# EAGLE design stamp_module (EAGLE 8.0.0)
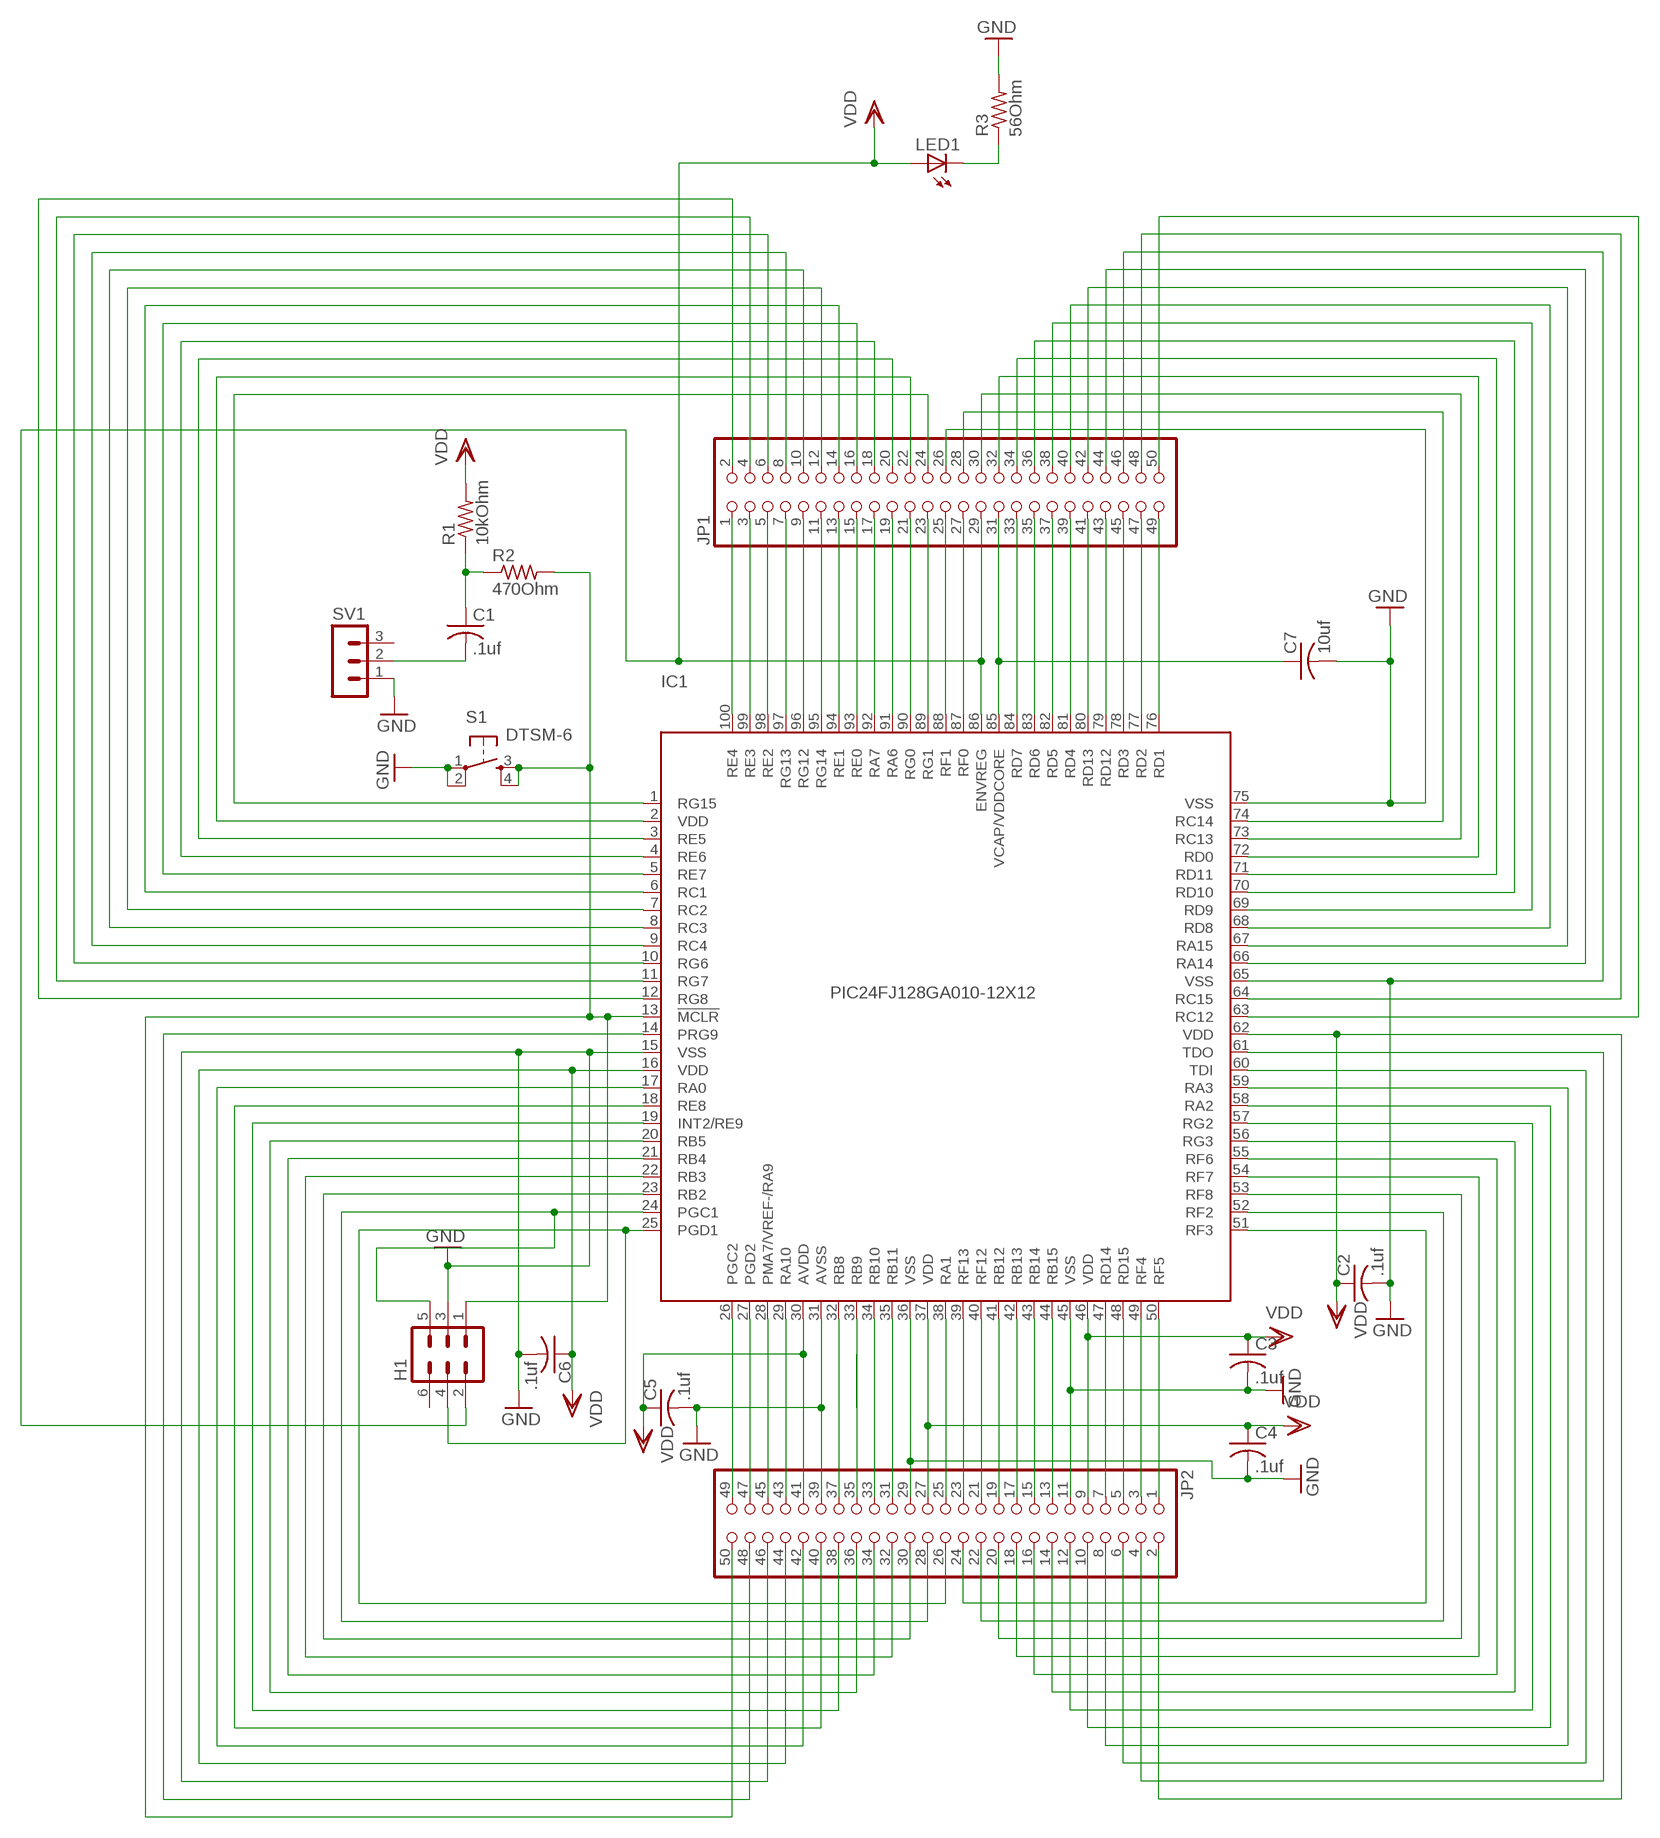
[diagram p0: schematic, sheet 1]

## Parts
C1  .1uf  C-USC1206  [C1206]
C2  .1uf  C-USC1206  [C1206]
C3  .1uf  C-USC1206  [C1206]
C4  .1uf  C-USC1206  [C1206]
C5  .1uf  C-USC1206  [C1206]
C6  .1uf  C-USC1206  [C1206]
C7  10uf  C-USC1206  [C1206]
H1  MA03-2  [MA03-2]
IC1  PIC24FJ128GA010-12X12  [SQFP-S-12X12-100]
JP1  PINHD-2X25  [2X25]
JP2  PINHD-2X25  [2X25]
LED1  LEDCHIPLED_0805  [CHIPLED_0805]
R1  10kOhm  R-US_R1206  [R1206]
R2  470Ohm  R-US_R1206  [R1206]
R3  56Ohm  R-US_R0805  [R0805]
S1  DTSM-6  [DTSM-6]
SV1  MA03-1  [MA03-1]

## Nets
GND: C2.2 C3.2 C4.2 C5.2 C6.2 C7.2 H1.3 IC1.15(VSS) IC1.31(AVSS) IC1.36(VSS) IC1.45(VSS) IC1.65(VSS) IC1.75(VSS) JP1.26 JP1.46 JP2.11 JP2.29 JP2.39 JP2.46 R3.2 S1.1 S1.2 SV1.1
N$1: IC1.88(RF1) JP1.25
N$2: C1.2 SV1.2
N$3: LED1.C R3.1
N$4: H1.5 IC1.24(PGC1) JP2.28
N$5: H1.1 IC1.13(!MCLR) JP2.50 R2.2 S1.3 S1.4
N$6: IC1.74(RC14) JP1.28
N$7: IC1.73(RC13) JP1.30
N$8: IC1.72(RD0) JP1.32
N$9: IC1.71(RD11) JP1.34
N$10: IC1.70(RD10) JP1.36
N$11: C1.1 R1.1 R2.1
N$12: IC1.69(RD9) JP1.38
N$13: IC1.68(RD8) JP1.40
N$14: IC1.67(RA15) JP1.42
N$15: IC1.66(RA14) JP1.44
N$16: H1.4 IC1.25(PGD1) JP2.26
N$17: IC1.61(TDO) JP2.4
N$18: IC1.64(RC15) JP1.48
N$19: IC1.63(RC12) JP1.50
N$20: IC1.60(TDI) JP2.6
N$21: IC1.59(RA3) JP2.8
N$22: IC1.58(RA2) JP2.10
N$23: IC1.57(RG2) JP2.12
N$24: IC1.56(RG3) JP2.14
N$25: IC1.55(RF6) JP2.16
N$26: IC1.54(RF7) JP2.18
N$27: IC1.53(RF8) JP2.20
N$28: IC1.52(RF2) JP2.22
N$29: IC1.51(RF3) JP2.24
N$30: IC1.50(RF5) JP2.1
N$31: IC1.49(RF4) JP2.3
N$32: IC1.38(RA1) JP2.25
N$33: IC1.47(RD14) JP2.7
N$34: IC1.44(RB15) JP2.13
N$35: IC1.34(RB10) JP2.33
N$36: IC1.42(RB13) JP2.17
N$37: IC1.41(RB12) JP2.19
N$38: IC1.40(RF12) JP2.21
N$39: IC1.39(RF13) JP2.23
N$40: IC1.48(RD15) JP2.5
N$41: IC1.35(RB11) JP2.31
N$42: IC1.43(RB14) JP2.15
N$43: IC1.33(RB9) JP2.35
N$44: IC1.32(RB8) JP2.37
N$45: IC1.29(RA10) JP2.43
N$46: IC1.28(PMA7/VREF-/RA9) JP2.45
N$47: IC1.27(PGD2) JP2.47
N$48: IC1.26(PGC2) JP2.49
N$49: IC1.4(RE6) JP1.18
N$50: IC1.6(RC1) JP1.14
N$51: IC1.3(RE5) JP1.20
N$52: IC1.2(VDD) JP1.22
N$53: IC1.5(RE7) JP1.16
N$54: IC1.7(RC2) JP1.12
N$55: IC1.8(RC3) JP1.10
N$56: IC1.9(RC4) JP1.8
N$57: IC1.10(RG6) JP1.6
N$58: IC1.11(RG7) JP1.4
N$59: IC1.12(RG8) JP1.2
N$60: IC1.14(PRG9) JP2.48
N$61: IC1.17(RA0) JP2.42
N$62: IC1.18(RE8) JP2.40
N$63: IC1.19(INT2/RE9) JP2.38
N$64: IC1.20(RB5) JP2.36
N$65: IC1.21(RB4) JP2.34
N$66: IC1.22(RB3) JP2.32
N$67: IC1.23(RB2) JP2.30
N$68: IC1.100(RE4) JP1.1
N$69: IC1.99(RE3) JP1.3
N$70: IC1.98(RE2) JP1.5
N$71: IC1.97(RG13) JP1.7
N$72: IC1.96(RG12) JP1.9
N$73: IC1.95(RG14) JP1.11
N$74: IC1.94(RE1) JP1.13
N$75: IC1.93(RE0) JP1.15
N$76: IC1.92(RA7) JP1.17
N$77: IC1.91(RA6) JP1.19
N$78: IC1.90(RG0) JP1.21
N$79: IC1.89(RG1) JP1.23
N$80: C7.1 IC1.85(VCAP/VDDCORE) JP1.31
N$81: IC1.87(RF0) JP1.27
N$82: IC1.84(RD7) JP1.33
N$83: IC1.83(RD6) JP1.35
N$84: IC1.82(RD5) JP1.37
N$85: IC1.81(RD4) JP1.39
N$86: IC1.80(RD13) JP1.41
N$87: IC1.79(RD12) JP1.43
N$88: IC1.78(RD3) JP1.45
N$89: IC1.77(RD2) JP1.47
N$90: IC1.76(RD1) JP1.49
N$91: IC1.1(RG15) JP1.24
VDD: C2.1 C3.1 C4.1 C5.1 C6.1 H1.2 IC1.16(VDD) IC1.30(AVDD) IC1.37(VDD) IC1.46(VDD) IC1.62(VDD) IC1.86(ENVREG) JP1.29 JP2.2 JP2.9 JP2.27 JP2.41 JP2.44 LED1.A R1.2
Unconnected: H1.6 SV1.3

## Library data of the parts
C1-C7 = rcl:C-US: CAPACITOR, American symbol
H1 = con-lstb:MA03-2: PIN HEADER; OC_FARNELL: unknown; OC_NEWARK: unknown
IC1 = ECE477_project:PIC24FJ128GA010: 64/80/100-Pin General Purpose, 16-Bit Flash Microcontrollers Source: http://ww1.microchip.com/downloads/en/DeviceDoc/39747d.pdf
JP1 JP2 = pinhead:PINHD-2X25: PIN HEADER
LED1 = led:LED: LED OSRAM: - CHIPLED LG R971, LG N971, LY N971, LG Q971, LY Q971, LO R971, LY R971 LH N974, LH R974 LS Q976, LO Q976, LY Q976 LO Q996 - Hyper CHIPLED LW Q18S LB Q993, LB Q99A, LB R99A - SideLED LS A670, LO A670, LY A670, LG A670, LP A670 LB A673, LV A673, LT A673, LW A673 LH A674 LY A675 LS A676, LA A676, LO A676, LY A676, LW A676 LS A679, LY A679, LG A679 - Hyper Micro SIDELED® LS Y876, LA Y876, LO Y876, LY Y876 LT Y87S - SmartLED LW L88C, LW L88S LB L89C, LB L89S, LG L890 LS L89K, LO L89K, LY L89K LS L896, LA L896, LO L896, LY L896 - TOPLED LS T670, LO T670, LY T670, LG T670, LP T670 LSG T670, LSP T670, LSY T670, LOP T670, LYG T670 LG T671, LOG T671, LSG T671 LB T673, LV T673, LT T673, LW T673 LH T674 LS T676, LA T676, LO T676, LY T676, LB T676, LH T676, LSB T676, LW T676 LB T67C, LV T67C, LT T67C, LS T67K, LO T67K, LY T67K, LW E67C LS E67B, LA E67B, LO E67B, LY E67B, LB E67C, LV E67C, LT E67C LW T67C LS T679, LY T679, LG T679 LS T770, LO T770, LY T770, LG T770, LP T770 LB T773, LV T773, LT T773, LW T773 LH T774 LS E675, LA E675, LY E675, LS T675 LS T776, LA T776, LO T776, LY T776, LB T776 LHGB T686 LT T68C, LB T68C - Hyper Mini TOPLED® LB M676 - Mini TOPLED Santana® LG M470 LS M47K, LO M47K, LY M47K Source: http://www.osram.convergy.de LUXEON: - LUMILED® LXK2-PW12-R00, LXK2-PW12-S00, LXK2-PW14-U00, LXK2-PW14-V00 LXK2-PM12-R00, LXK2-PM12-S00, LXK2-PM14-U00 LXK2-PE12-Q00, LXK2-PE12-R00, LXK2-PE12-S00, LXK2-PE14-T00, LXK2-PE14-U00 LXK2-PB12-K00, LXK2-PB12-L00, LXK2-PB12-M00, LXK2-PB14-N00, LXK2-PB14-P00, LXK2-PB14-Q00 LXK2-PR12-L00, LXK2-PR12-M00, LXK2-PR14-Q00, LXK2-PR14-R00 LXK2-PD12-Q00, LXK2-PD12-R00, LXK2-PD12-S00 LXK2-PH12-R00, LXK2-PH12-S00 LXK2-PL12-P00, LXK2-PL12-Q00, LXK2-PL12-R00 Source: www.luxeon.com KINGBRIGHT: KA-3528ASYC Source: www.kingbright.com
R1-R3 = rcl:R-US_: RESISTOR, American symbol
S1 = switch-tact:DTSM-6
SV1 = con-lstb:MA03-1: PIN HEADER; OC_FARNELL: unknown; OC_NEWARK: unknown

## Board
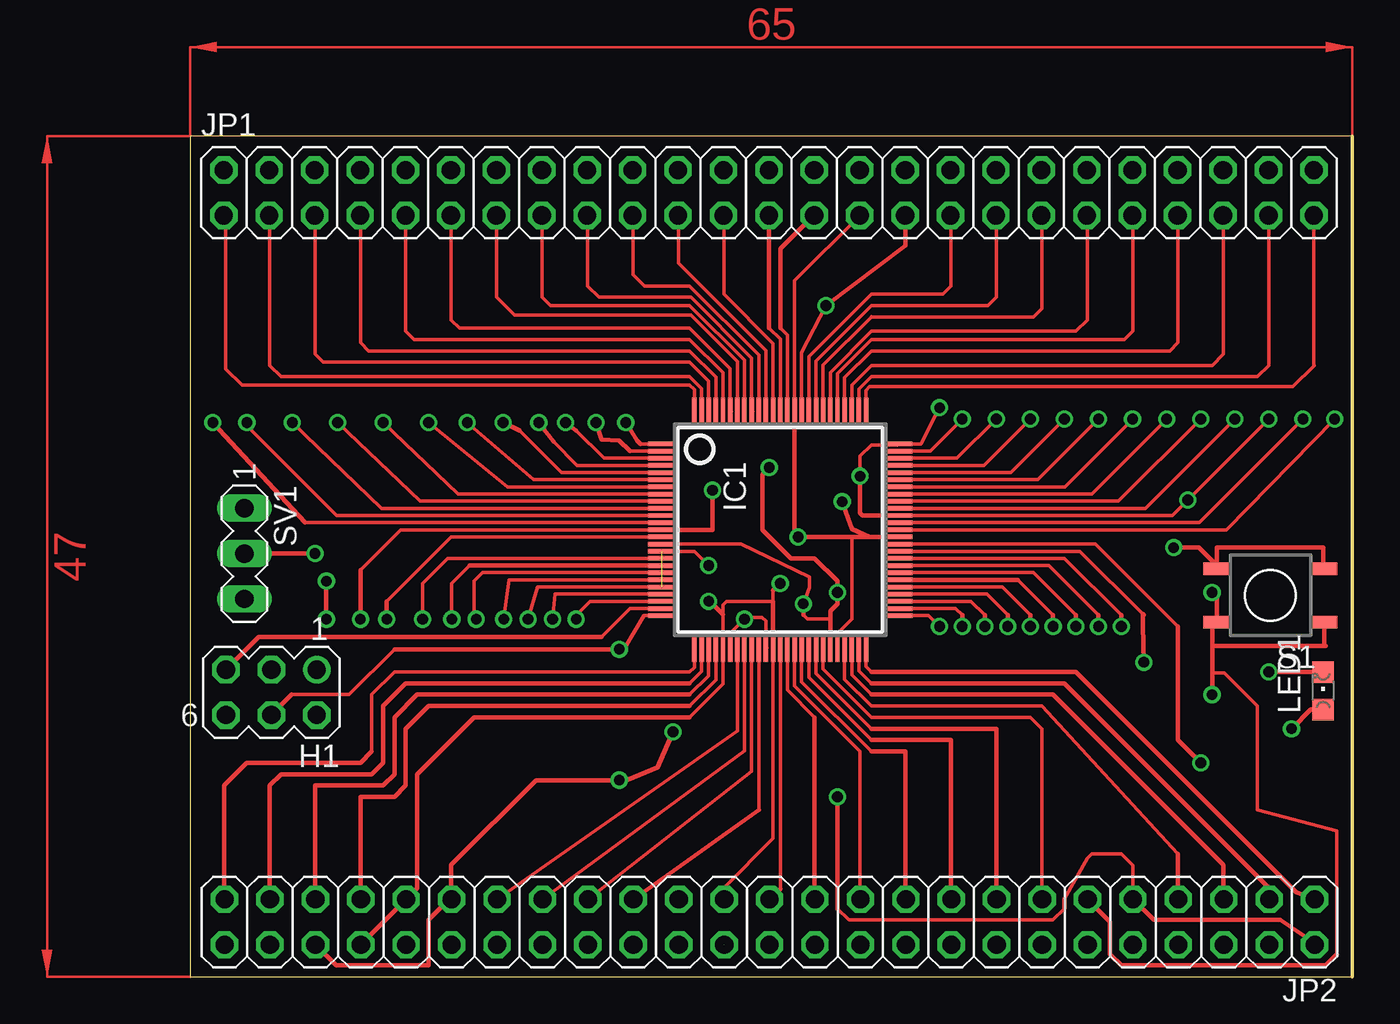
[diagram p1: board, top side]
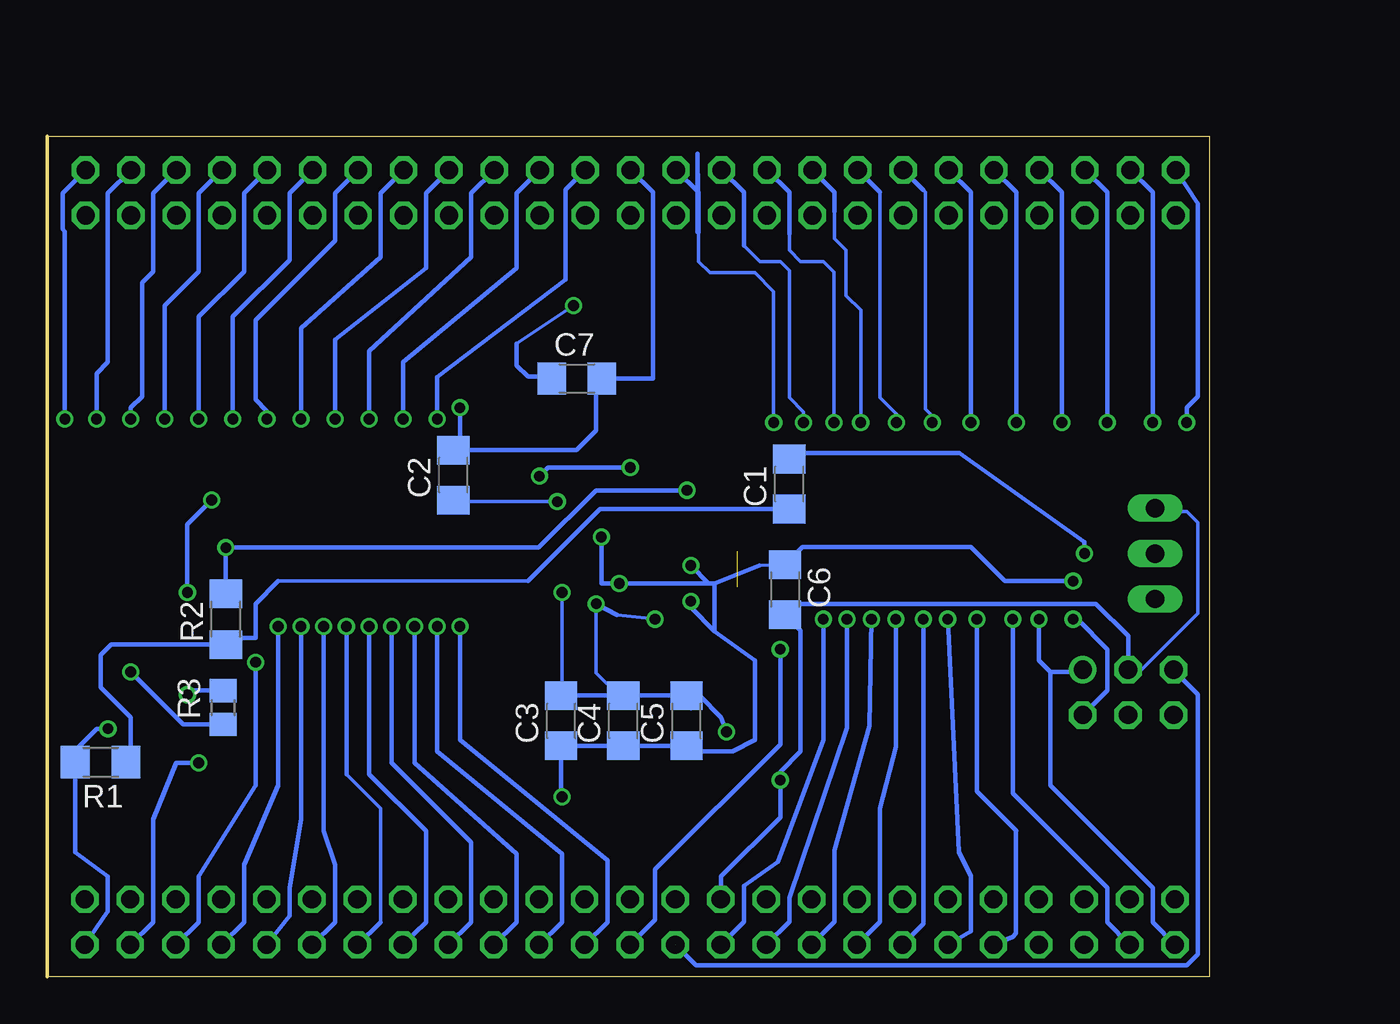
[diagram p2: board, bottom side, seen from below]

Size 65 x 47 mm. Coordinates in mm from the lower left corner, seen from the top.
Outline: 0,0 65,0 65,47 0,47 0,0
Copper layers (1*16): Top 0.0356mm / dielectric 1.5011mm / Bottom 0.0356mm
Design rules "ECE_Senior_Design": minimum track width 8mil, minimum drill 13mil, track to track 8mil, track to pad 8mil, pad to pad 6mil, via to via 8mil, smd to smd 6mil, copper to edge 15mil, drill to drill 8mil, minimum pad ring 7mil, minimum via ring 7mil, stop-mask expansion 3mil, vias tented up to drill 0mil, thermal gap 10mil

### Footprints (pad centres in the part's own frame; a part is rotated, then mirrored left to right if it is on the bottom)
C1206 = smd 1.6 x 1.8: 1 -1.4,0; 2 1.4,0
MA03-2 = drill 1.016: 1 -2.54,-1.27 | drill 1.016 octagon: 2 -2.54,1.27; 3 0,-1.27; 4 0,1.27; 5 2.54,-1.27; 6 2.54,1.27
SQFP-S-12X12-100 = smd 0.25 x 1.6: 1 -4.8,-6.6; 2 -4.4,-6.6; 3 -4,-6.6; 4 -3.6,-6.6; 5 -3.2,-6.6; 6 -2.8,-6.6; 7 -2.4,-6.6; 8 -2,-6.6; 9 -1.6,-6.6; 10 -1.2,-6.6; 11 -0.8,-6.6; 12 -0.4,-6.6; 13 0,-6.6; 14 0.4,-6.6; 15 0.8,-6.6; 16 1.2,-6.6; 17 1.6,-6.6; 18 2,-6.6; 19 2.4,-6.6; 20 2.8,-6.6; 21 3.2,-6.6; 22 3.6,-6.6; 23 4,-6.6; 24 4.4,-6.6; 25 4.8,-6.6; 51 4.8,6.6; 52 4.4,6.6; 53 4,6.6; 54 3.6,6.6; 55 3.2,6.6; 56 2.8,6.6; 57 2.4,6.6; 58 2,6.6; 59 1.6,6.6; 60 1.2,6.6; 61 0.8,6.6; 62 0.4,6.6; 63 0,6.6; 64 -0.4,6.6; 65 -0.8,6.6; 66 -1.2,6.6; 67 -1.6,6.6; 68 -2,6.6; 69 -2.4,6.6; 70 -2.8,6.6; 71 -3.2,6.6; 72 -3.6,6.6; 73 -4,6.6; 74 -4.4,6.6; 75 -4.8,6.6 | smd 1.6 x 0.25: 26 6.6,-4.8; 27 6.6,-4.4; 28 6.6,-4; 29 6.6,-3.6; 30 6.6,-3.2; 31 6.6,-2.8; 32 6.6,-2.4; 33 6.6,-2; 34 6.6,-1.6; 35 6.6,-1.2; 36 6.6,-0.8; 37 6.6,-0.4; 38 6.6,0; 39 6.6,0.4; 40 6.6,0.8; 41 6.6,1.2; 42 6.6,1.6; 43 6.6,2; 44 6.6,2.4; 45 6.6,2.8; 46 6.6,3.2; 47 6.6,3.6; 48 6.6,4; 49 6.6,4.4; 50 6.6,4.8; 76 -6.6,4.8; 77 -6.6,4.4; 78 -6.6,4; 79 -6.6,3.6; 80 -6.6,3.2; 81 -6.6,2.8; 82 -6.6,2.4; 83 -6.6,2; 84 -6.6,1.6; 85 -6.6,1.2; 86 -6.6,0.8; 87 -6.6,0.4; 88 -6.6,0; 89 -6.6,-0.4; 90 -6.6,-0.8; 91 -6.6,-1.2; 92 -6.6,-1.6; 93 -6.6,-2; 94 -6.6,-2.4; 95 -6.6,-2.8; 96 -6.6,-3.2; 97 -6.6,-3.6; 98 -6.6,-4; 99 -6.6,-4.4; 100 -6.6,-4.8
2X25 = drill 1.016 octagon: 1 -30.48,-1.27; 2 -30.48,1.27; 3 -27.94,-1.27; 4 -27.94,1.27; 5 -25.4,-1.27; 6 -25.4,1.27; 7 -22.86,-1.27; 8 -22.86,1.27; 9 -20.32,-1.27; 10 -20.32,1.27; 11 -17.78,-1.27; 12 -17.78,1.27; 13 -15.24,-1.27; 14 -15.24,1.27; 15 -12.7,-1.27; 16 -12.7,1.27; 17 -10.16,-1.27; 18 -10.16,1.27; 19 -7.62,-1.27; 20 -7.62,1.27; 21 -5.08,-1.27; 22 -5.08,1.27; 23 -2.54,-1.27; 24 -2.54,1.27; 25 0,-1.27; 26 0,1.27; 27 2.54,-1.27; 28 2.54,1.27; 29 5.08,-1.27; 30 5.08,1.27; 31 7.62,-1.27; 32 7.62,1.27; 33 10.16,-1.27; 34 10.16,1.27; 35 12.7,-1.27; 36 12.7,1.27; 37 15.24,-1.27; 38 15.24,1.27; 39 17.78,-1.27; 40 17.78,1.27; 41 20.32,-1.27; 42 20.32,1.27; 43 22.86,-1.27; 44 22.86,1.27; 45 25.4,-1.27; 46 25.4,1.27; 47 27.94,-1.27; 48 27.94,1.27; 49 30.48,-1.27; 50 30.48,1.27
CHIPLED_0805 = smd 1.2 x 1.2: A 0,-1.05; C 0,1.05
R1206 = smd 1.6 x 1.803: 1 -1.422,0; 2 1.422,0
R0805 = smd 1.3 x 1.5: 1 -0.95,0; 2 0.95,0
DTSM-6 = smd 1.5 x 0.7: 1 -3,1.5; 2 3,1.5; 3 -3,-1.5; 4 3,-1.5
MA03-1 = drill 1.016 long: 1 -2.54,0; 2 0,0; 3 2.54,0

### Placement (x,y rotation side)
C1  23.5,27.56 90 bottom
C2  42.27,28.05 90 bottom
C3  36.25,14.32 90 bottom
C4  32.78,14.32 90 bottom
C5  29.25,14.32 90 bottom
C6  23.73,21.66 270 bottom
C7  35.38,33.45 0 bottom
H1  4.54,15.91 180 top
IC1  33,25 270 top
JP1  32.37,43.85 0 top
JP2  32.41,3.06 180 top
LED1  63.37,16 0 top
R1  62,12 180 bottom
R2  55,20 90 bottom
R3  55.16,15.06 90 bottom
S1  60.41,21.33 180 top
SV1  3.04,23.66 270 top

### Tracks (layer width: path | path; a pad name or v marks a point on that pad's centre or on a via)
GND  (via drill 0.6)
  Top 0.203: v60.33,31.2 v55.79,26.66 54.93,25.8 IC1.65 | v41.91,31.83 40.88,29.8 IC1.75 39.55,29.75 38.1,29.75 37.47,29.11 v37.47,28 | 35.8,20 34.52,20 34.29,20.23 | 57.15,17 57.84,17 59.69,15.14 59.69,9.34 64.14,8.16 64.14,1.27 | IC1.15 30.8,24.2 34.63,22.36 34.63,21.79 v34.29,20.86 | IC1.31 30.2,19.2 v31,20 31.1,20.1 31.99,20.1 32.2,19.89 IC1.36
  Top 0.254: 32.23,18.4 IC1.36 | S1.2 58,19.83 58,20 | S1.2 57.15,19.83 57.15,18.51 | 57.15,18.51 63.41,18.51 | 63.5,18.51 63.41,18.51 | 63.41,18.51 S1.1 | v57.15,15.78 57.15,17 57.15,18.51 | S1.2 57.41,21.23 v57.15,21.5 | IC1.45 35.8,20 35.8,20.46 36.2,20.86 v36.2,21.5 36.2,22.13 34.92,23.4 33.6,23.4 32,25 32,28.09 v32.38,28.48 | 34.29,20.23 v34.29,20.86 | JP2.46 8.16,0.64 13.34,0.64 13.34,3.17 14.49,4.33 JP2.39 14.61,4.35 14.61,6.25 19.35,11 v24,11 24.13,10.87 26.13,11.7 v27,13.7 | 64.14,1.27 63.5,0.64 52.07,0.64 51.44,1.27 51.44,3.08 JP2.11 | IC1.65 37.6,25.8 37.47,25.94 v37.47,28
  Bottom 0.203: v34.29,20.86 34.29,17 33.02,15.72 | 33.13,20.23 v31,20 | v36.2,21.5 36.2,15.92 36,15.72 | H1.3 3.77,17.18 0.64,20.32 0.64,25.4 1.27,26.04 2.87,26.04 SV1.1
  Bottom 0.254: v60.33,31.2 60.33,31.83 59.69,32.47 59.69,38.81 59.05,39.45 59.05,43.83 JP1.46 | v41.91,31.83 41.91,29.82 C2.2 35.4,29.45 34.29,30.56 34.29,33.14 C7.2 31.11,33.45 31.11,43.87 JP1.26 | R3.2 56.92,16.01 v57.15,15.78 | C5.2 C4.2 33.02,15.72 36,15.72 C3.2 36.2,15.78 | v57.15,21.5 57.15,25.3 v55.79,26.66 | H1.3 4.54,19.05 6.35,20.86 23.12,20.86 C6.2 22.86,19.39 22.86,12.61 24,11.46 v24,11 24,8.93 27.3,5.62 27.3,4.35 JP2.29 | C5.2 29.25,15.24 29,15 | C5.2 28.52,15.72 27.3,14.51 v27,13.7 | v34.29,20.86 33.13,20.23 | v32.38,28.48 36.98,28.48 v37.47,28
N$1
  Top 0.203: IC1.88 33,35.66 32.38,36.27
  Top 0.254: 32.38,36.27 32.38,42.56 JP1.25
N$2  (via drill 0.6)
  Top 0.254: SV1.2 6.67,23.66 7,24 7,23.68 v6.99,23.67
  Bottom 0.254: v6.99,23.67 6.99,24.3 13.97,29.29 23.16,29.29 C1.2
N$3  (via drill 0.6)
  Top 0.254: v60.33,17.05 LED1.C
  Bottom 0.254: R3.1 57.38,14.11 v60.33,17.05
N$4  (1 unrouted)
  Top 0.203: IC1.24 24.6,20.6 23,19
  Top 0.254: H1.5 3.83,19 23,19
  Bottom 0.254: H1.5 2,17.15 0.64,15.78 0.64,1.27 1.27,0.64 28.71,0.64 JP2.28
N$5  (via drill 0.6)
  Top 0.203: IC1.13 11.76,25 9.53,22.77
  Top 0.254: S1.3 63.37,22.83 63.37,24 57.41,24 57.41,23 | 57.41,23 S1.4 | v55,24 56.41,24 57.41,23 | 9.53,22.77 v9.53,20 | v29.21,27.21 29.21,25 IC1.13
  Bottom 0.254: R2.2 v55,24 37.5,24 34.29,27.21 v29.21,27.21 | v9.53,20 9.53,17.68 8.89,17.05 | 8.89,17.05 7.21,17.05 H1.1 | 8.89,17.05 8.89,10.7 3.17,4.99 3.17,3.04 JP2.50
N$6  (via drill 0.6)
  Top 0.203: IC1.74 41.38,29.4 v43.18,31.2
  Bottom 0.254: v43.18,31.2 43.18,33.55 36,39 36,44.02 JP1.28
N$7  (via drill 0.6)
  Top 0.203: IC1.73 42.89,29 v45.09,31.2
  Bottom 0.254: v45.09,31.2 45.09,34.37 38.73,39.62 38.73,43.83 JP1.30
N$8  (via drill 0.6)
  Top 0.203: IC1.72 44.4,28.6 v46.99,31.2
  Bottom 0.254: v46.99,31.2 46.99,35.01 41.27,40.26 41.27,43.83 JP1.32
N$9  (via drill 0.6)
  Top 0.203: IC1.71 45.9,28.2 v48.9,31.2
  Bottom 0.254: v48.9,31.2 48.9,35.64 43.81,39.62 43.81,43.83 JP1.34
N$10  (via drill 0.6)
  Top 0.203: IC1.70 47.41,27.8 v50.8,31.2
  Bottom 0.254: v50.8,31.2 50.8,36.27 46.35,40.26 46.35,43.83 JP1.36
N$11
  Bottom 0.203: 38.1,22.13 52.07,22.13
  Bottom 0.254: 60.55,11.97 R1.1 60.47,12.11 60.33,12.25 60.33,14.51 62,16.18 62,18 61.42,18.58 R2.1 55,18.95 53.34,18.95 53.34,20.86 52.07,22.13 | C1.1 34.07,26.16 38.1,22.13
N$12  (via drill 0.6)
  Top 0.203: IC1.69 48.91,27.4 v52.7,31.2
  Bottom 0.254: JP1.38 48.9,43.83 48.9,41.18 53.34,36.73 53.34,32.29 52.7,31.66 v52.7,31.2
N$13  (via drill 0.6)
  Top 0.203: IC1.68 50.41,27 v54.61,31.2
  Bottom 0.254: v54.61,31.2 54.61,36.91 51.44,40.09 51.44,43.83 JP1.40
N$14  (via drill 0.6)
  Top 0.203: IC1.67 51.92,26.6 v56.52,31.2
  Bottom 0.254: v56.52,31.2 56.52,36.91 53.98,39.45 53.98,43.83 JP1.42
N$15  (via drill 0.6)
  Top 0.203: IC1.66 53.42,26.2 v58.42,31.2
  Bottom 0.254: v58.42,31.2 58.42,37.55 56.52,39.45 56.52,43.83 JP1.44
N$16  (via drill 0.6)
  Top 0.203: IC1.25 25.38,20.2 24.32,18.41 | 11.43,18.32 8.89,15.78 5.68,15.78
  Top 0.254: 23.5,18.32 24.32,18.41 23.82,18.41 v24,18.32 23.5,18.32 | 23.5,18.32 11.43,18.32 | 5.68,15.78 H1.4
  Bottom 0.254: v24,18.32 24,13 31,6 31,3.19 JP2.26 32.79,1.79 33,2
N$17  (via drill 0.6)
  Top 0.203: IC1.61 50.63,24.2 55.24,19.59
  Top 0.254: 55.24,19.59 55.24,13.24 v56.52,11.97
  Bottom 0.254: v56.52,11.97 57.78,11.97 59.05,8.79 59.05,3.04 JP2.4
N$18  (via drill 0.6)
  Top 0.203: IC1.64 56.44,25.4 v62.23,31.2
  Bottom 0.254: v62.23,31.2 62.23,33.73 61.59,34.37 61.59,43.83 JP1.48
N$19  (via drill 0.6)
  Top 0.203: IC1.63 57.94,25 v64,31.2
  Bottom 0.254: v64,31.2 64,41.68 64.14,41.81 64.14,43.83 62.98,44.98 JP1.50
N$20  (via drill 0.6)
  Top 0.203: IC1.60 49.77,23.8 53.28,20.28
  Top 0.254: 53.34,20.23 53.28,20.28 53.28,19.65 v53.34,17.59
  Bottom 0.254: v53.34,17.59 53.34,10.7 56.52,5.62 56.52,3.04 JP2.6
N$21  (via drill 0.6)
  Top 0.203: IC1.59 48.9,23.4 52.07,20.23
  Top 0.254: 52.07,20.23 v52.07,19.59
  Bottom 0.254: v52.07,19.59 52.07,10.7 53.98,6.25 53.98,3.04 JP2.8
N$22  (via drill 0.6)
  Top 0.203: IC1.58 48.02,23 50.8,20.23
  Top 0.254: 50.8,20.23 v50.8,19.59
  Bottom 0.254: v50.8,19.59 50.8,8.79 51.44,4.99 51.44,3.4 JP2.10
N$23  (via drill 0.6)
  Top 0.203: IC1.57 47.16,22.6 49.53,20.23
  Top 0.254: 49.53,20.23 v49.53,19.59
  Bottom 0.254: v49.53,19.59 49.53,8.16 48.9,6.25 48.9,3.04 JP2.12
N$24  (via drill 0.6)
  Top 0.203: 46.28,22.2 48.26,20.23
  Top 0.254: IC1.56 46.28,22.2 | 48.26,20.23 v48.26,19.59
  Bottom 0.203: 48.26,11.34 46.35,9.43 46.35,3.04
  Bottom 0.254: v48.26,19.59 48.26,11.34 | 46.35,3.04 JP2.14
N$25  (via drill 0.6)
  Top 0.203: IC1.55 45.41,21.8 46.99,20.23
  Top 0.254: 46.99,20.23 v46.99,19.59
  Bottom 0.254: v46.99,19.59 46.99,11.34 43.81,8.16 43.81,3.04 JP2.16
N$26  (via drill 0.6)
  Top 0.203: IC1.54 44.55,21.4 45.72,20.23
  Top 0.254: 45.72,20.23 v45.72,19.59
  Bottom 0.254: v45.72,19.59 45.72,11.97 41.27,7.53 41.27,3.04 JP2.18
N$27  (via drill 0.6)
  Top 0.203: IC1.53 43.67,21 44.45,20.23
  Top 0.254: 44.45,20.23 v44.45,19.59
  Bottom 0.254: v44.45,19.59 44.45,11.97 38.73,6.89 38.73,3.04 JP2.20
N$28  (via drill 0.6)
  Top 0.203: IC1.52 42.8,20.6 43.18,20.23
  Top 0.254: 43.18,20.23 v43.18,19.59
  Bottom 0.254: v43.18,19.59 43.18,12.61 36.2,6.89 36.2,3.04 JP2.22
N$29  (via drill 0.6)
  Top 0.203: IC1.51 41.3,20.2 v41.91,19.59
  Bottom 0.254: v41.91,19.59 41.91,13.24 33.66,6.53 33.66,3.04 JP2.24
N$30
  Top 0.203: IC1.50 37.8,17.35 38.1,17.05
  Top 0.254: 38.1,17.05 49.53,17.05 61.87,4.71 62.87,4.35 JP2.1
N$31
  Top 0.203: IC1.49 37.4,17.11 38.1,16.41
  Top 0.254: 38.1,16.41 48.9,16.41 60.33,4.99 60.33,4.35 JP2.3
N$32
  Top 0.203: IC1.38 33,4.92
  Top 0.254: 33,4.92 JP2.25
N$33
  Top 0.203: IC1.47 36.6,16.64 38.1,15.14 47.62,15.14 55.24,6.89
  Top 0.254: 55.24,6.89 55.24,4.35 JP2.7
N$34
  Top 0.203: 47.62,4.35 47.62,13.88 46.99,14.51 38.1,14.51 35.4,17.21 IC1.44
  Top 0.254: 47.62,4.35 JP2.13
N$35
  Top 0.203: IC1.34 31.4,11.48 JP2.33
N$36
  Top 0.203: IC1.42 34.6,16.74 38.1,13.24
  Top 0.254: 38.1,13.24 42.55,13.24 42.55,4.35 JP2.17
N$37
  Top 0.203: IC1.41 34.2,16.5 38.1,12.61
  Top 0.254: 38.1,12.61 40.01,12.61 40.01,4.35 JP2.19
N$38
  Top 0.203: IC1.40 33.8,16.27 37.47,12.61 37.47,4.35
  Top 0.254: 37.47,4.35 JP2.21
N$39
  Top 0.203: IC1.39 33.4,16.04 34.92,14.51
  Top 0.254: 34.92,14.51 34.92,4.35 JP2.23
N$40
  Top 0.203: IC1.48 37,16.88 38.1,15.78
  Top 0.254: 38.1,15.78 48.26,15.78 57.78,6.25 57.78,4.35 JP2.5
N$41
  Top 0.203: IC1.35 31.8,9.35
  Top 0.254: 31.8,9.35 JP2.31
N$42
  Top 0.203: IC1.43 35,16.98 38.1,13.88
  Top 0.254: 38.1,13.88 45.09,13.88 45.09,4.35 JP2.15
N$43
  Top 0.203: IC1.33 31,12.62 JP2.35
N$44
  Top 0.203: IC1.32 30.6,13.77 JP2.37
N$45
  Top 0.203: IC1.29 29.4,16.61 27.94,15.14
  Top 0.254: 27.94,15.14 13.34,15.14 12.06,13.88 12.06,10.7 11.43,10.06 9.53,10.06 9.53,4.35 JP2.43
N$46
  Top 0.203: IC1.28 29,16.84 27.94,15.78
  Top 0.254: 27.94,15.78 12.7,15.78 11.43,14.51 11.43,11.34 10.79,10.7 6.99,10.7 6.99,4.35 JP2.45
N$47
  Top 0.203: IC1.27 28.6,17.07 27.94,16.41
  Top 0.254: 27.94,16.41 12.06,16.41 10.79,15.14 10.79,11.97 10.16,11.34 5.08,11.34 4.45,10.7 4.45,4.35 JP2.47
N$48
  Top 0.203: IC1.26 28.2,17.31 27.94,17.05 11.43,17.05 10.16,15.78 10.16,12.61
  Top 0.254: 10.16,12.61 9.53,11.97 3.17,11.97 1.91,10.7 1.91,4.35 JP2.49
N$49  (via drill 0.6)
  Top 0.203: IC1.4 21.64,28.6 20.32,29.93
  Top 0.254: 20.32,29.93 v19.5,31
  Bottom 0.203: v19.5,31 19.5,37.28 20.32,38.1 20.32,40.64 20.95,41.27 20.95,43
  Bottom 0.254: 20.95,42.8 20.95,43 20.95,43.87 JP1.18
N$50  (via drill 0.6)
  Top 0.203: IC1.6 19.2,27.8 v15.5,31
  Bottom 0.203: v15.5,31 15.5,31.38 15.88,31.75 15.88,43.88 16,44
  Bottom 0.254: 16,44 JP1.14
N$51  (via drill 0.6)
  Top 0.203: IC1.3 23.15,29 21.59,30.56
  Top 0.254: 21.59,30.56 v21,31
  Bottom 0.203: v21,31 21,39.41 21.59,40.01 22.86,40.01 23.5,40.64 23.5,42
  Bottom 0.254: JP1.20 23.5,43.87 23.5,42 23.5,41.53
N$52  (via drill 0.6)
  Top 0.203: IC1.2 24.6,29.4
  Top 0.254: 24.6,29.4 24,30 23,30.05 v22.7,31
  Bottom 0.203: v22.7,31 22.7,31.59 23.5,32.38 23.5,39.49 24,40 25.14,40 26.04,40.9
  Bottom 0.254: JP1.22 26.04,43.87 26.04,40.9
N$53  (via drill 0.6)
  Top 0.203: IC1.5 20.77,28.2 18.41,30.56
  Top 0.254: 18.41,30.56 v17.5,31
  Bottom 0.203: v17.5,31 17.5,31.47 18.41,32.38 18.41,43.87
  Bottom 0.254: 18.41,43.87 JP1.16
N$54  (via drill 0.6)
  Top 0.203: IC1.7 17.77,27.4 v13.34,31
  Bottom 0.254: v13.34,31 13.34,43.87 JP1.12
N$55  (via drill 0.6)
  Top 0.203: IC1.8 14.99,27 v10.79,31
  Bottom 0.254: v10.79,31 10.79,43.87 JP1.10
N$56  (via drill 0.6)
  Top 0.203: IC1.9 12.85,26.6 v8.26,31
  Bottom 0.254: v8.26,31 8.26,43.87 JP1.8
N$57  (via drill 0.6)
  Top 0.203: IC1.10 10.71,26.2 v5.71,31
  Bottom 0.254: v5.71,31 5.71,43.87 JP1.6
N$58  (via drill 0.6)
  Top 0.203: IC1.11 8.2,25.8 3,31
  Top 0.254: 3,31 3,31.02 v3.17,31
  Bottom 0.254: v3.17,31 3.17,43.87 JP1.4
N$59  (via drill 0.6)
  Top 0.203: IC1.12 6.43,25.4
  Top 0.254: 6.43,25.4 v1.27,31
  Bottom 0.254: v1.27,31 1.27,31.83 0.64,32.47 0.64,43.23 JP1.2
N$60  (via drill 0.6)
  Top 0.203: IC1.14 14.6,24.6 11,21
  Top 0.254: 11,21 v11,20
  Bottom 0.254: v11,20 11,10.27 5.71,4.99 5.71,3.04 JP2.48
N$61  (via drill 0.6)
  Top 0.203: IC1.17 14.4,23.4 13,22 v13,20
  Bottom 0.254: JP2.42 11,2.24 10.82,2.42 10.82,8.18 | v13,20 13,10.37 10.82,8.18 | 10.82,8.18 10.79,8.16
N$62  (via drill 0.6)
  Top 0.203: 15.63,23 14.63,22 v14.63,20
  Top 0.254: IC1.18 15.63,23
  Bottom 0.254: v14.63,20 14,7 13.34,5.62 13.34,2.54 JP2.40
N$63  (via drill 0.6)
  Top 0.203: IC1.19 16.34,22.6 15.88,22.13 15.88,20.12
  Top 0.254: 15.88,20.12 v16,20
  Bottom 0.254: v16,20 16,2.96 JP2.38
N$64  (via drill 0.6)
  Top 0.203: IC1.20 17.84,22.2 v17.54,20
  Bottom 0.254: v17.54,20 17.54,12.85 18.41,9.43 18.41,3.08 JP2.36
N$65  (via drill 0.6)  (1 unrouted)
  Top 0.203: IC1.21 19.43,21.8 v18.91,20
  Bottom 0.254: v18.91,20 19,14.02 20.95,7.07 20.95,3.08 JP2.34
N$66  (via drill 0.6)
  Top 0.203: IC1.22 20.4,21.4 v20.27,20
  Bottom 0.254: v20.27,20 20.27,13.93 23.5,4.43 23.5,3.08 JP2.32
N$67  (via drill 0.6)
  Top 0.203: IC1.23 22.36,21 21.68,20.32
  Top 0.254: 21.68,20.32 v21.59,20
  Bottom 0.254: v21.59,20 21.59,13.24 24.13,6.43 26.04,5.08 26.04,3.08 JP2.30
N$68
  Top 0.203: IC1.100 28.2,32.84 27.94,33.1 3,33.1 2.9,33.1 2,34 2,42.47 JP1.1
  Top 0.254: 28.2,32.2 IC1.100 | JP1.1 1.91,42.56
N$69
  Top 0.203: IC1.99 28.6,32.9 27.94,33.56 5.08,33.56 4.45,34.2 4.45,42.56 JP1.3
N$70
  Top 0.203: IC1.98 29,33.31 27.94,34.37 7.45,34.37 6.99,34.83 6.99,42.56
  Top 0.254: JP1.5 6.99,42.56
N$71
  Top 0.203: IC1.97 29.4,33.55 27.94,35.01 9.98,35.01 9.53,35.47 9.53,42.56
  Top 0.254: JP1.7 9.53,42.56
N$72
  Top 0.203: IC1.96 29.8,33.78 27.94,35.64 12.53,35.64 12.06,36.1 12.06,42.56
  Top 0.254: JP1.9 12.06,42.56
N$73
  Top 0.203: IC1.95 30.2,34.02 27.94,36.27 15.06,36.27 14.61,36.73 14.61,42.45 | 14.61,42.45 14.61,42.56 | JP1.11 14.59,42.47 14.61,42.45
  Top 0.254: 30.23,31.6 IC1.95 | 14.61,42.56 JP1.11
N$74
  Top 0.203: IC1.94 30.6,34.4 28,37 18.15,37 17.14,38.01 17.14,42.56 JP1.13
N$75
  Top 0.203: IC1.93 31,34.48 27.94,37.55 20.14,37.55 19.68,38.01 19.68,42.56
  Top 0.254: JP1.15 19.68,42.56
N$76
  Top 0.203: IC1.92 31.4,34.6 28,38 22.86,38 22.23,38.64 22.23,42.56 JP1.17
  Top 0.254: 31.43,31.6 IC1.92
N$77
  Top 0.203: IC1.91 31.8,34.78 27.94,38.64 25.4,38.64 24.77,39.27 24.77,42.56 JP1.19
N$78
  Top 0.203: IC1.90 32.2,35.02 27.3,39.91 27.3,42.56 JP1.21
N$79
  Top 0.203: IC1.89 32.6,35.42 29.84,38.18 29.84,42.56
  Top 0.254: 29.84,42.56 JP1.23
N$80  (via drill 0.6)
  Top 0.203: IC1.85 34.2,34.91 v35.56,37.55
  Top 0.254: v35.56,37.55 40.01,40.9 40.01,42.56 JP1.31
  Bottom 0.203: v35.56,37.55 38.73,35.41
  Bottom 0.254: 38.73,35.41 38.73,34.2 38.1,33.56 36.88,33.56 C7.1
N$81
  Top 0.203: IC1.87 33.4,35.9 33.02,36.27
  Top 0.254: 33.02,36.27 33.02,40.72 34.92,42.62 34.92,42.56 JP1.27
N$82
  Top 0.203: IC1.84 34.6,34.68 37.96,38.04 38.1,38.18 42.09,38.18 42.55,38.64 42.55,42.56
  Top 0.254: JP1.33 42.55,42.56
N$83
  Top 0.203: IC1.83 35,34.45 38.1,37.55 44.62,37.55 45.09,38.01 45.09,42.56
  Top 0.254: JP1.35 45.09,42.56
N$84
  Top 0.203: IC1.82 35.4,34.21 38.09,36.91 | 38.09,36.91 38.1,36.91 | 38.09,36.91 47.16,36.91 47.62,37.37 47.62,42.56
  Top 0.254: JP1.37 47.62,42.56
N$85
  Top 0.203: IC1.81 35.8,33.8 38.1,36.1 49.53,36.1 50.16,36.73 50.16,42.45 | 50.16,42.45 50.16,42.56 JP1.39 50.15,42.47 50.16,42.45
N$86
  Top 0.203: IC1.80 36.2,33.74 38.1,35.64 52.24,35.64 52.7,36.1 52.7,42.56 JP1.41
N$87
  Top 0.203: IC1.79 36.6,33.51 38.1,35.01 54.78,35.01 55.24,35.47 55.24,42.56 JP1.43
N$88
  Top 0.203: IC1.78 37,33.09 38.1,34.2 57.15,34.2 57.78,34.83 57.78,42.56
  Top 0.254: JP1.45 57.78,42.56
N$89
  Top 0.203: IC1.77 37.4,32.86 38.1,33.56 59.69,33.56 60.33,34.2 60.33,42 | 60.33,42 60.33,42.56 | JP1.47 60.3,42.02 60.33,42
  Top 0.254: 60.33,42.56 JP1.47
N$90
  Top 0.203: IC1.76 37.8,32.8 38,33 61.67,33 62.84,34.16 | 62.84,34.16 62.87,34.2 | 62.84,34.16 JP1.49
  Top 0.254: 37.8,32.16 IC1.76 | JP1.49 62.87,42.56
N$91  (via drill 0.6)
  Top 0.203: IC1.1 25.2,29.8
  Top 0.254: 25.2,29.8 25,30 v24.36,31
  Bottom 0.203: v24.36,31 24.36,38.34 25.4,39.37 27.94,39.37 28.57,40.01 28.57,42.55
  Bottom 0.254: 28.64,41.63 28.64,46.03 28.57,41.61 28.57,42.55 28.57,43.87 JP1.24
VDD  (via drill 0.6)
  Top 0.203: 27.94,14.51 29.8,16.37 IC1.30 29.8,20.8 30,21 32.6,21 32.6,21.6 | IC1.16 28.2,23.8 v29,23 | 36.2,3.81 36.83,3.17 48.26,3.17 48.9,3.81 | 48.9,4.35 50.16,6.62 50.44,6.89 52.07,6.89 52.73,6.24 JP2.9 | IC1.46 36.2,19.2 37,20 37,24.6 | IC1.37 32.6,7.74 29.84,4.99 29.84,4.35 JP2.27 | IC1.86 33.8,38.94 JP1.29
  Top 0.254: LED1.A 62.67,14.95 v61.59,13.88 | 29.8,20.27 29.21,20.86 29.14,20.86 v29,21 | 32.6,21 IC1.37 | 32.6,21.6 v33,22 | JP2.44 JP2.41 12.7,4.95 12.7,11.34 15.88,14.51 27.94,14.51 | v7.62,20 v7.62,22.13 | JP2.2 62.88,1.89 60.96,3.17 53.88,3.17 JP2.9 52.7,4.35 | IC1.62 38,24.6 | 38,24.6 37,24.6 v34,24.6 33.8,24.6 IC1.86 | 38,24.6 37,25.04 v36.47,26.57 | v36.2,10.06 36.2,3.81 | 48.9,3.81 48.9,4.35
  Bottom 0.203: C6.1 25.15,23 | v36.47,26.57 42.2,26.57
  Bottom 0.254: v61.59,13.88 62.23,13.88 64.14,11.97 64,11.97 | 64,11.97 63.45,11.97 R1.2 | v29,21 29,20.65 27.68,19.32 | 27.68,19.32 25.4,17.68 25.4,13.24 26.67,12.61 28.93,12.61 C5.1 C4.1 C3.1 36.25,10.12 v36.2,10.06 | 27.68,19.32 27.68,22 | 28,22 v33,22 34,22 v34,24.6 | 28,22 27.68,22 | 27.68,22 25.15,23 | v29,23 28,22 | v7.62,22.13 11.43,22.13 13.34,24.04 22.75,24.04 C6.1 | R1.2 63.97,12 64,11.97 | R1.2 63.42,6.97 61.59,5.62 61.59,3.67 JP2.2 | 42.2,26.57 C2.1 | v7.62,20 7.39,20 5.71,18.32 5.71,16.01 H1.2
(copper drawn outside any net)
  shapes: Top area x2